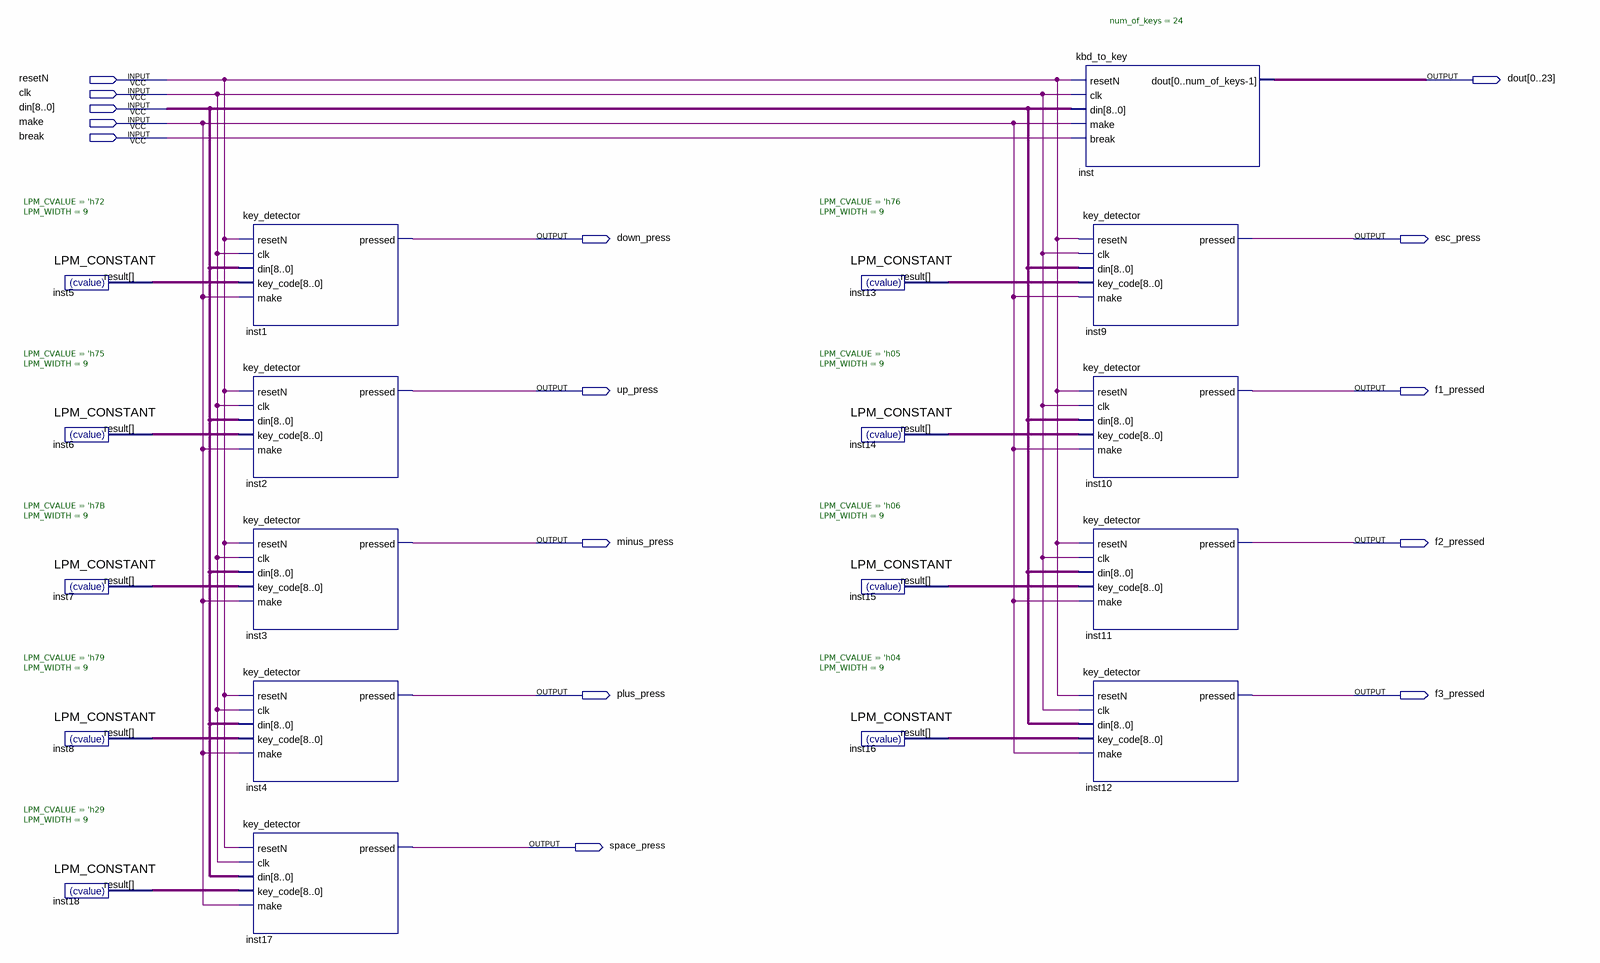
[diagram p0: schematic sheet]
// Quartus schematic kbd_logic.bdf as structural Verilog: 19 symbols, 15 pins
module kbd_logic (
  input  resetN,
  input  clk,
  input  [8:0] din,
  input  make,
  input  \break ,
  output [0:23] dout,
  output down_press,
  output esc_press,
  output up_press,
  output f1_pressed,
  output minus_press,
  output f2_pressed,
  output plus_press,
  output f3_pressed,
  output space_press
);

  wire [8:0] inst5_result, inst6_result, inst7_result, inst8_result, inst13_result, inst14_result,
       inst15_result, inst16_result, inst18_result;

  LPM_CONSTANT #(.LPM_CVALUE('h72), .LPM_WIDTH(9)) inst5 (.result(inst5_result));
  LPM_CONSTANT #(.LPM_CVALUE('h75), .LPM_WIDTH(9)) inst6 (.result(inst6_result));
  LPM_CONSTANT #(.LPM_CVALUE('h7B), .LPM_WIDTH(9)) inst7 (.result(inst7_result));
  LPM_CONSTANT #(.LPM_CVALUE('h79), .LPM_WIDTH(9)) inst8 (.result(inst8_result));
  LPM_CONSTANT #(.LPM_CVALUE('h29), .LPM_WIDTH(9)) inst18 (.result(inst18_result));
  key_detector inst1 (
    .resetN(resetN), .clk(clk), .din(din), .key_code(inst5_result), .make(make), .pressed(down_press));
  key_detector inst2 (.resetN(resetN), .clk(clk), .din(din), .key_code(inst6_result), .make(make), .pressed(up_press));
  key_detector inst3 (
    .resetN(resetN), .clk(clk), .din(din), .key_code(inst7_result), .make(make), .pressed(minus_press));
  key_detector inst4 (
    .resetN(resetN), .clk(clk), .din(din), .key_code(inst8_result), .make(make), .pressed(plus_press));
  key_detector inst17 (
    .resetN(resetN), .clk(clk), .din(din), .key_code(inst18_result), .make(make), .pressed(space_press));
  LPM_CONSTANT #(.LPM_CVALUE('h76), .LPM_WIDTH(9)) inst13 (.result(inst13_result));
  LPM_CONSTANT #(.LPM_CVALUE('h05), .LPM_WIDTH(9)) inst14 (.result(inst14_result));
  LPM_CONSTANT #(.LPM_CVALUE('h06), .LPM_WIDTH(9)) inst15 (.result(inst15_result));
  LPM_CONSTANT #(.LPM_CVALUE('h04), .LPM_WIDTH(9)) inst16 (.result(inst16_result));
  kbd_to_key #(.num_of_keys(24)) inst (
    .resetN(resetN), .clk(clk), .din(din), .make(make), .\break (\break ), .dout(dout));
  key_detector inst9 (
    .resetN(resetN), .clk(clk), .din(din), .key_code(inst13_result), .make(make), .pressed(esc_press));
  key_detector inst10 (
    .resetN(resetN), .clk(clk), .din(din), .key_code(inst14_result), .make(make), .pressed(f1_pressed));
  key_detector inst11 (
    .resetN(resetN), .clk(clk), .din(din), .key_code(inst15_result), .make(make), .pressed(f2_pressed));
  key_detector inst12 (
    .resetN(resetN), .clk(clk), .din(din), .key_code(inst16_result), .make(make), .pressed(f3_pressed));
endmodule
